# Altium project sonar_board_rev_2013A.PrjPcb
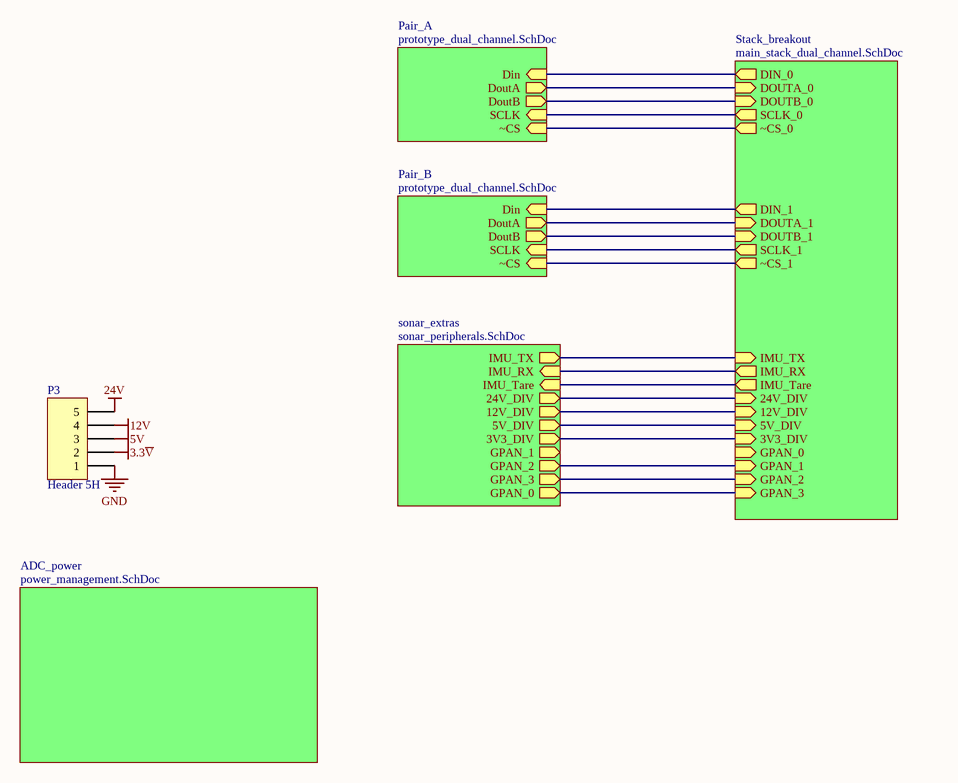
[diagram p0: sonar_board_rev_2013A.SchDoc]
7 sheets, 127 parts. Net scope: hierarchical (ports join the sheet entries above them; power ports are global).
Board file: Sonar_board.PcbDoc
Sheets:
  sonar_board_rev_2013A.SchDoc
    Pair_A = prototype_dual_channel.SchDoc
      Sallen_key_bandpass = Sallen_key_bandpass.SchDoc
      Biasing_circuitry = bias_LNA.SchDoc
      Sallen_key_bandpass = Sallen_key_bandpass.SchDoc
      Biasing_circuitry = bias_LNA.SchDoc
    Pair_B = prototype_dual_channel.SchDoc
      Sallen_key_bandpass = Sallen_key_bandpass.SchDoc
      Biasing_circuitry = bias_LNA.SchDoc
      Sallen_key_bandpass = Sallen_key_bandpass.SchDoc
      Biasing_circuitry = bias_LNA.SchDoc
    Stack_breakout = main_stack_dual_channel.SchDoc
    ADC_power = power_management.SchDoc
    sonar_extras = sonar_peripherals.SchDoc

## Sheet sonar_board_rev_2013A.SchDoc
size A

### Parts
P3  Header 5H  [HDR1X5H]

### Sub-sheets
ADC_power = power_management.SchDoc: no entries
Pair_A = prototype_dual_channel.SchDoc: Din (in), DoutA (out), DoutB (out), SCLK (in), ~CS (in)
Pair_B = prototype_dual_channel.SchDoc: SCLK (in), ~CS (in), DoutA (out), DoutB (out), Din (in)
sonar_extras = sonar_peripherals.SchDoc: IMU_TX (out), IMU_RX (in), IMU_Tare (in), 24V_DIV (out), 12V_DIV (out), 5V_DIV (out), 3V3_DIV (out), GPAN_1 (out), GPAN_2 (out), GPAN_3 (out), GPAN_0 (out)
Stack_breakout = main_stack_dual_channel.SchDoc: DIN_0 (out), DIN_1 (out), DOUTA_0 (in), DOUTA_1 (in), DOUTB_0 (in), DOUTB_1 (in), SCLK_0 (out), SCLK_1 (out), ~CS_0 (out), ~CS_1 (out), IMU_TX (in), IMU_RX (out), IMU_Tare (out), 24V_DIV (in), 12V_DIV (in), 5V_DIV (in), 3V3_DIV (in), GPAN_1 (in), GPAN_3 (in), GPAN_0 (in), GPAN_2 (in)

### Nets
3.3~{V}: P3.2
5V: P3.3
12V: P3.4
24V: P3.5
GND: P3.1
NetADC1_1_23: sheet Pair_A/Din, sheet Stack_breakout/DIN_0
NetADC1_1_31: sheet Pair_A/DoutB, sheet Stack_breakout/DOUTB_0
NetADC1_1_32: sheet Pair_A/DoutA, sheet Stack_breakout/DOUTA_0
NetADC1_1_34: sheet Pair_A/SCLK, sheet Stack_breakout/SCLK_0
NetADC1_1_35: sheet Pair_A/~CS, sheet Stack_breakout/~CS_0
NetADC1_2_23: sheet Pair_B/Din, sheet Stack_breakout/DIN_1
NetADC1_2_31: sheet Pair_B/DoutB, sheet Stack_breakout/DOUTB_1
NetADC1_2_32: sheet Pair_B/DoutA, sheet Stack_breakout/DOUTA_1
NetADC1_2_34: sheet Pair_B/SCLK, sheet Stack_breakout/SCLK_1
NetADC1_2_35: sheet Pair_B/~CS, sheet Stack_breakout/~CS_1
NetC25_2: sheet Stack_breakout/GPAN_3, sheet sonar_extras/GPAN_0
NetC26_2: sheet Stack_breakout/24V_DIV, sheet sonar_extras/24V_DIV
NetC28_2: sheet Stack_breakout/12V_DIV, sheet sonar_extras/12V_DIV
NetC29_2: sheet Stack_breakout/GPAN_1, sheet sonar_extras/GPAN_2
NetC30_2: sheet Stack_breakout/5V_DIV, sheet sonar_extras/5V_DIV
NetC31_2: sheet Stack_breakout/GPAN_2, sheet sonar_extras/GPAN_3
NetC32_2: sheet Stack_breakout/3V3_DIV, sheet sonar_extras/3V3_DIV
NetMS_T1_82: sheet Stack_breakout/IMU_RX, sheet sonar_extras/IMU_RX
NetMS_T1_83: sheet Stack_breakout/IMU_Tare, sheet sonar_extras/IMU_Tare
NetP4_3: sheet Stack_breakout/IMU_TX, sheet sonar_extras/IMU_TX

### Library data of the parts
P3 = Header 5H: Header, 5-Pin, Right Angle; LatestRevisionDate: 17-Jul-2002; LatestRevisionNote: Re-released for DXP Platform.; Publisher: Altium Limited

## Sheet prototype_dual_channel.SchDoc
size A
Used 2 times, as channels Pair_A, Pair_B. Parts and nets are listed once, with the designators drawn on the sheet.
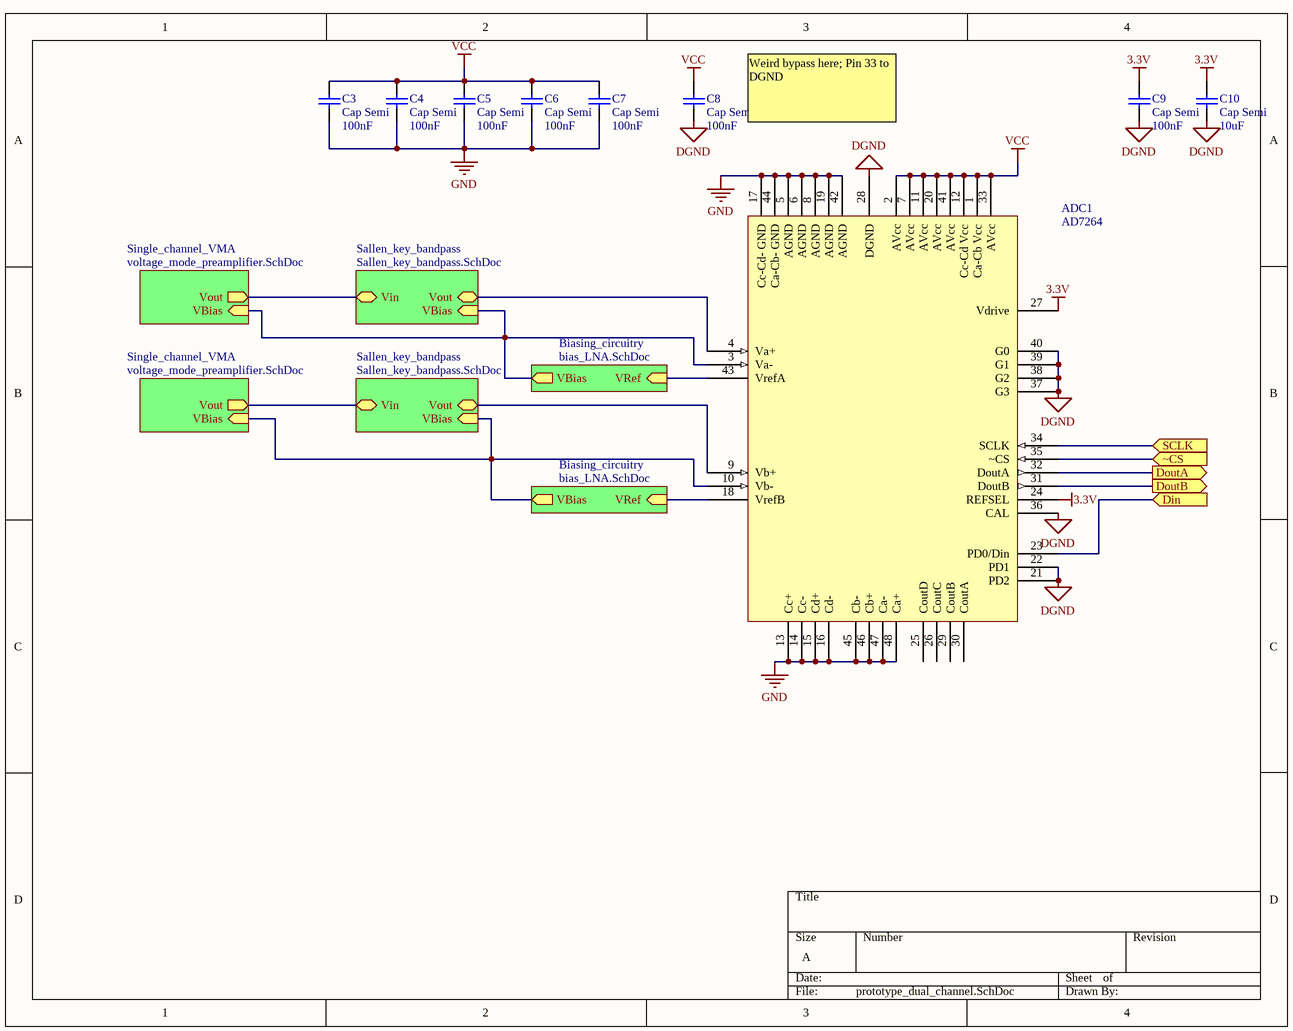
[diagram p1: prototype_dual_channel.SchDoc]

### Parts
ADC1  AD7264  [TSQFP50P900X900-48N]
C3  Cap Semi  value 100nF  [C0805]
C4  Cap Semi  value 100nF  [C0805]
C5  Cap Semi  value 100nF  [C0805]
C6  Cap Semi  value 100nF  [C0805]
C7  Cap Semi  value 100nF  [C0805]
C8  Cap Semi  value 100nF  [C0805]
C9  Cap Semi  value 100nF  [C0805]
C10  Cap Semi  value 10uF  [C0805]

### Sub-sheets
Biasing_circuitry = bias_LNA.SchDoc: VRef (in), VBias (out)
Biasing_circuitry = bias_LNA.SchDoc: VRef (in), VBias (out)
Sallen_key_bandpass = Sallen_key_bandpass.SchDoc: VBias (in), Vin, Vout
Sallen_key_bandpass = Sallen_key_bandpass.SchDoc: VBias (in), Vin, Vout
Single_channel_VMA = voltage_mode_preamplifier.SchDoc (file not in this document): Vout (out), VBias (in)
Single_channel_VMA = voltage_mode_preamplifier.SchDoc (file not in this document): Vout (out), VBias (in)

### Ports
Din (in), DoutA (out), DoutB (out), SCLK (in), ~CS (in)

### Nets
3.3V: ADC1.24(REFSEL) ADC1.27(Vdrive) C9.2 C10.2
DGND: ADC1.21(PD2) ADC1.22(PD1) ADC1.28(DGND) ADC1.36(CAL) ADC1.37(G3) ADC1.38(G2) ADC1.39(G1) ADC1.40(G0) C8.1 C9.1 C10.1
GND: ADC1.5(AGND) ADC1.6(AGND) ADC1.8(AGND) ADC1.13(Cc+) ADC1.14(Cc-) ADC1.15(Cd+) ADC1.16(Cd-) ADC1.17(Cc-Cd-_GND) ADC1.19(AGND) ADC1.42(AGND) ADC1.44(Ca-Cb-_GND) ADC1.45(Cb-) ADC1.46(Cb+) ADC1.47(Ca-) ADC1.48(Ca+) C3.1 C4.1 C5.1 C6.1 C7.1
VCC: ADC1.1(Ca-Cb_Vcc) ADC1.2(AVcc) ADC1.7(AVcc) ADC1.11(AVcc) ADC1.12(Cc-Cd_Vcc) ADC1.20(AVcc) ADC1.33(AVcc) ADC1.41(AVcc) C3.2 C4.2 C5.2 C6.2 C7.2 C8.2
Din: ADC1.23(PD0/Din) ; port Din
DoutA: ADC1.32(DoutA) ; port DoutA
DoutB: ADC1.31(DoutB) ; port DoutB
SCLK: ADC1.34(SCLK) ; port SCLK
~CS: ADC1.35(~CS) ; port ~CS
NetADC1_3: ADC1.3(Va-) ; sheet Single_channel_VMA/VBias, sheet Sallen_key_bandpass/VBias, sheet Biasing_circuitry/VBias
NetADC1_4: ADC1.4(Va+) ; sheet Sallen_key_bandpass/Vout
NetADC1_9: ADC1.9(Vb+) ; sheet Sallen_key_bandpass/Vout
NetADC1_10: ADC1.10(Vb-) ; sheet Single_channel_VMA/VBias, sheet Sallen_key_bandpass/VBias, sheet Biasing_circuitry/VBias
NetADC1_18: ADC1.18(VrefB) ; sheet Biasing_circuitry/VRef
NetADC1_43: ADC1.43(VrefA) ; sheet Biasing_circuitry/VRef
(unnamed): sheet Single_channel_VMA/Vout, sheet Sallen_key_bandpass/Vin
(unnamed): sheet Single_channel_VMA/Vout, sheet Sallen_key_bandpass/Vin

Not connected (* = marked no-connect by the designer): ADC1 25(CoutD) 26(CoutC) 29(CoutB) 30(CoutA)

### Channels
Pair_A: designators end in _1; ports Din=NetADC1_1_23 DoutA=NetADC1_1_32 DoutB=NetADC1_1_31 SCLK=NetADC1_1_34 ~CS=NetADC1_1_35
Pair_B: designators end in _2; ports Din=NetADC1_2_23 DoutA=NetADC1_2_32 DoutB=NetADC1_2_31 SCLK=NetADC1_2_34 ~CS=NetADC1_2_35

### Notes on the sheet
- Weird bypass here; Pin 33 to DGND

### Library data of the parts
ADC1 = AD7264: AD7264 - 14 bit 1MSPS 2 channel ADC; Datasheet: http://www.analog.com/static/imported-files/data_sheets/AD7264.pdf
C3-C10 = Cap Semi: Capacitor (Semiconductor SIM Model); Published: 8-Jun-2000; LatestRevisionDate: 29-May-2009; LatestRevisionNote: IPC-7351 Footprint Added.; PackageReference: C1206; Publisher: Altium Limited; PackageDescription: Chip Capacitor

## Sheet Sallen_key_bandpass.SchDoc
size A
Used 4 times, as channels Pair_A/Sallen_key_bandpass, Pair_A/Sallen_key_bandpass, Pair_B/Sallen_key_bandpass, Pair_B/Sallen_key_bandpass. Parts and nets are listed once, with the designators drawn on the sheet.
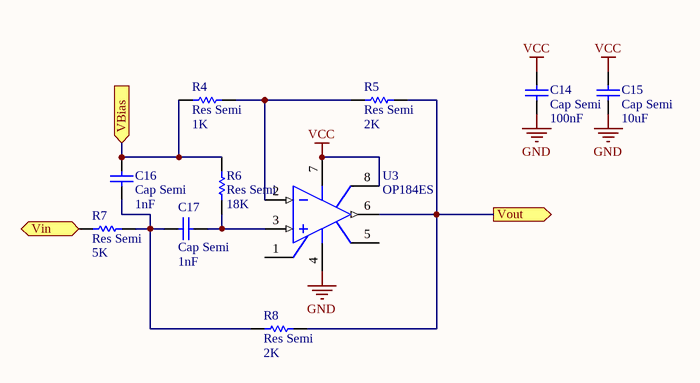
[diagram p2: Sallen_key_bandpass.SchDoc]

### Parts
C14  Cap Semi  value 100nF  [C0805]
C15  Cap Semi  value 10uF  [C1206]
C16  Cap Semi  value 1nF  [C0805]
C17  Cap Semi  value 1nF  [C0805]
R4  Res Semi  value 1K  [6-0805_M]
R5  Res Semi  value 2K  [6-0805_M]
R6  Res Semi  value 18K  [6-0805_M]
R7  Res Semi  value 5K  [6-0805_M]
R8  Res Semi  value 2K  [6-0805_M]
U3  OP184ES  [SO-8]

### Ports
VBias (in), Vin, Vout (out)

### Nets
GND: C14.1 C15.1 U3.4(V-)
VCC: C14.2 C15.2 U3.7(V+) U3.8(NC)
VBias: C16.2 R4.1 R6.2 ; port VBias
Vin: R7.1 ; port Vin
Vout: R5.2 R8.2 U3.6(OUT) ; port Vout
NetC16_1: C16.1 C17.2 R7.2 R8.1
NetC17_1: C17.1 R6.1 U3.3(IN+)
NetR4_2: R4.2 R5.1 U3.2(IN-)

Not connected (* = marked no-connect by the designer): U3 1(NUL) 5(NUL)

### Channels
Pair_A/Sallen_key_bandpass: designators end in _2; ports VBias=NetADC1_1_3 Vin=NetR7_2_1 Vout=NetADC1_1_4
Pair_A/Sallen_key_bandpass: designators end in _1; ports VBias=NetADC1_1_10 Vin=NetR7_1_1 Vout=NetADC1_1_9
Pair_B/Sallen_key_bandpass: designators end in _4; ports VBias=NetADC1_2_3 Vin=NetR7_4_1 Vout=NetADC1_2_4
Pair_B/Sallen_key_bandpass: designators end in _3; ports VBias=NetADC1_2_10 Vin=NetR7_3_1 Vout=NetADC1_2_9

### Library data of the parts
C14 C15 = Cap Semi: Capacitor (Semiconductor SIM Model); Published: 8-Jun-2000; LatestRevisionDate: 29-May-2009; LatestRevisionNote: IPC-7351 Footprint Added.; PackageReference: C1206; Publisher: Altium Limited; PackageDescription: Chip Capacitor
C16 = Cap Semi: Capacitor (Semiconductor SIM Model); Low-pass filter value: OPEN; Published: 8-Jun-2000; LatestRevisionDate: 29-May-2009; LatestRevisionNote: IPC-7351 Footprint Added.; PackageReference: C1206; Publisher: Altium Limited; PackageDescription: Chip Capacitor
C17 = Cap Semi: Capacitor (Semiconductor SIM Model); Low-pass filter value: R = 5K; Published: 8-Jun-2000; LatestRevisionDate: 29-May-2009; LatestRevisionNote: IPC-7351 Footprint Added.; PackageReference: C1206; Publisher: Altium Limited; PackageDescription: Chip Capacitor
R4 = Res Semi: Semiconductor Resistor; Low-pass filter value: OPEN; Published: 8-Jun-2000; LatestRevisionDate: 17-Jul-2002; LatestRevisionNote: Re-released for DXP Platform.; PackageReference: AXIAL-0.5; Publisher: Altium Limited
R5 = Res Semi: Semiconductor Resistor; Low-pass filter value: SHORT; Published: 8-Jun-2000; LatestRevisionDate: 17-Jul-2002; LatestRevisionNote: Re-released for DXP Platform.; PackageReference: AXIAL-0.5; Publisher: Altium Limited
R6 R8 = Res Semi: Semiconductor Resistor; Low-pass filter value: C = 120pF; Published: 8-Jun-2000; LatestRevisionDate: 17-Jul-2002; LatestRevisionNote: Re-released for DXP Platform.; PackageReference: AXIAL-0.5; Publisher: Altium Limited
R7 = Res Semi: Semiconductor Resistor; Low-pass filter value: R = 5k; Published: 8-Jun-2000; LatestRevisionDate: 17-Jul-2002; LatestRevisionNote: Re-released for DXP Platform.; PackageReference: AXIAL-0.5; Publisher: Altium Limited
U3 = OP184ES: Precision Rail-to-Rail Input and Ouput Operational Amplifier; Note: Pin 8 is not connected.; Published: 8-Jun-2000; LatestRevisionDate: 13-Apr-2006; LatestRevisionNote: IPC-7351 Footprint Added.; PackageVersion: revA; PackageReference: SO-8; Publisher: Altium Limited; PackageDescription: 8-Pin Small Outline Integrated Circuit 1.27 mm Pitch; Code_JEDEC: MS-012-AA; Code_IPC: SOIC127P600-8; Datasheet: http://www.analog.com/static/imported-files/data_sheets/OP184_284_484.pdf

## Sheet bias_LNA.SchDoc
size A
Used 4 times, as channels Pair_A/Biasing_circuitry, Pair_A/Biasing_circuitry, Pair_B/Biasing_circuitry, Pair_B/Biasing_circuitry. Parts and nets are listed once, with the designators drawn on the sheet.
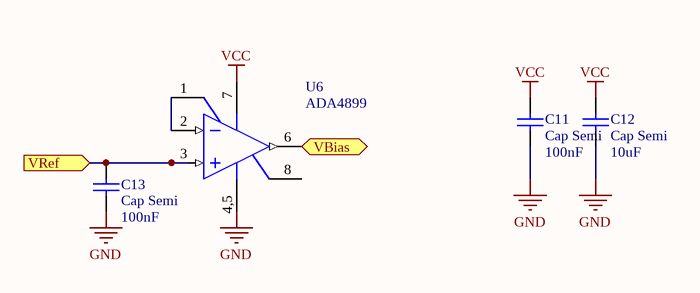
[diagram p3: bias_LNA.SchDoc]

### Parts
C11  Cap Semi  value 100nF  [C0805]
C12  Cap Semi  value 10uF  [C0805]
C13  Cap Semi  value 100nF  [C0805]
U6  ADA4899  [SO8_N]

### Ports
VBias (out), VRef (in)

### Nets
GND: C11.1 C12.1 C13.1 U6.4,5(V-)
VCC: C11.2 C12.2 U6.7(V+)
VBias: U6.6(OUT) ; port VBias
VRef: C13.2 U6.3(IN+) ; port VRef
NetU6_1: U6.1(FB) U6.2(IN-)

Not connected (* = marked no-connect by the designer): U6 8(CMPEN)

### Channels
Pair_A/Biasing_circuitry: designators C11=C11_2 C12=C12_2 C13=C13_2 U6=U2_2; ports VBias=NetADC1_1_3 VRef=NetADC1_1_43
Pair_A/Biasing_circuitry: designators C11=C11_1 C12=C12_1 C13=C13_1 U6=U2_1; ports VBias=NetADC1_1_10 VRef=NetADC1_1_18
Pair_B/Biasing_circuitry: designators C11=C11_4 C12=C12_4 C13=C13_4 U6=U2_4; ports VBias=NetADC1_2_3 VRef=NetADC1_2_43
Pair_B/Biasing_circuitry: designators C11=C11_3 C12=C12_3 C13=C13_3 U6=U2_3; ports VBias=NetADC1_2_10 VRef=NetADC1_2_18

### Library data of the parts
C11-C13 = Cap Semi: Capacitor (Semiconductor SIM Model); Published: 8-Jun-2000; LatestRevisionDate: 29-May-2009; LatestRevisionNote: IPC-7351 Footprint Added.; PackageReference: C1206; Publisher: Altium Limited; PackageDescription: Chip Capacitor
U6 = ADA4899: High Speed, Low Voltage Noise, Unity Gain Stable Op-Amp; Datasheet: http://www.analog.com/static/imported-files/data_sheets/ADA4899-1.pdf; Digikey Product Sheet: http://www.digikey.ca/product-search/en/integrated-circuits-ics/linear-amplifiers-instrumentation-op-amps-buffer-amps/2556125?k=ADA4899

## Sheet main_stack_dual_channel.SchDoc
size A
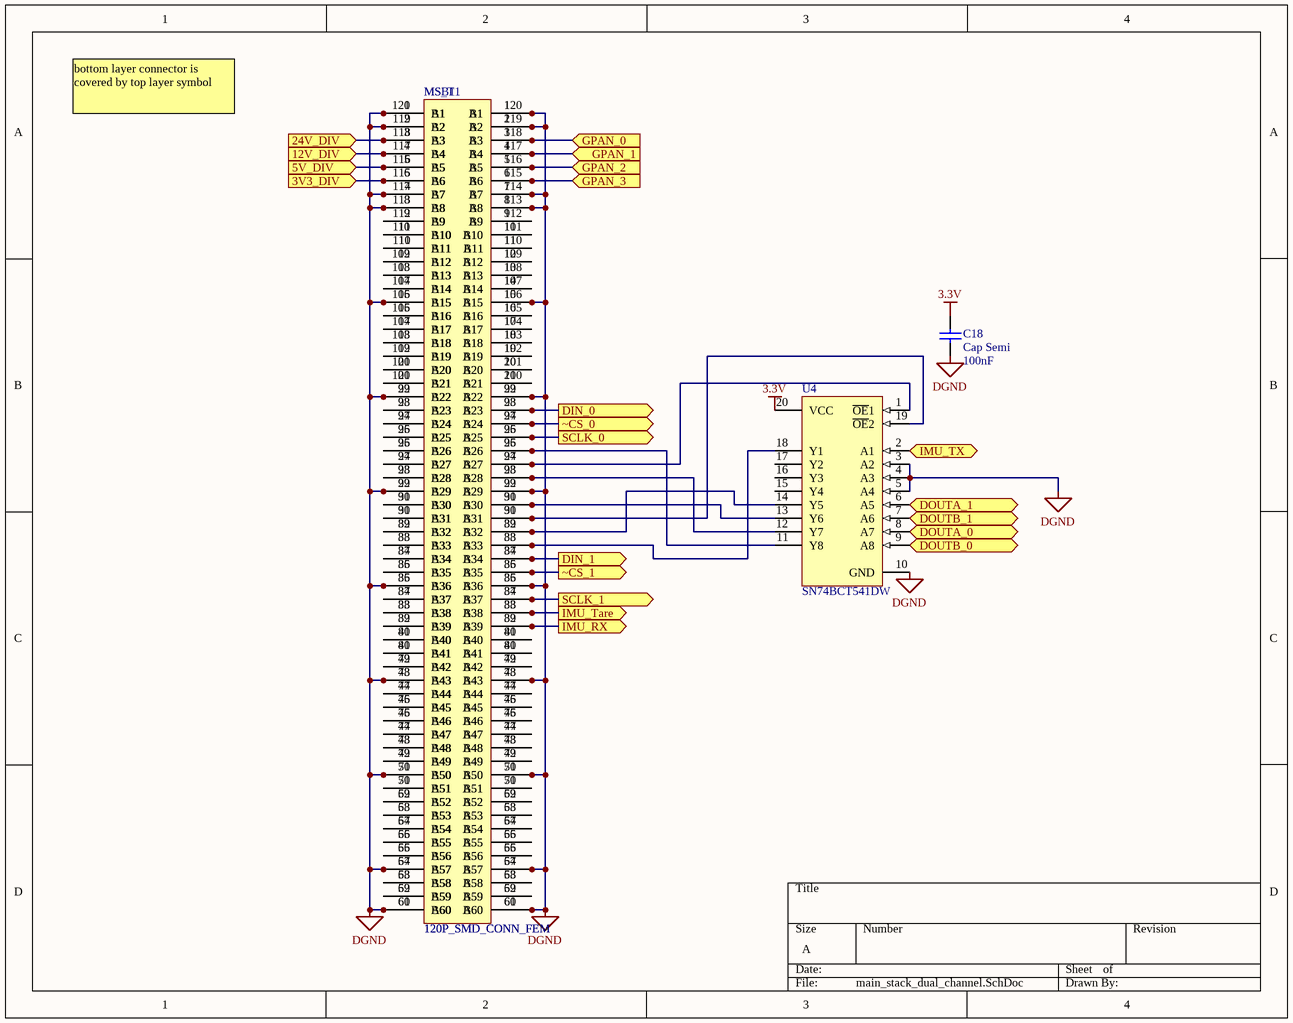
[diagram p4: main_stack_dual_channel.SchDoc]

### Parts
(Parts that share a designator on the sheet are numbered #1, #2 ... from top to bottom, then left to right.)
C18  Cap Semi  value 100nF  [C0805]
MS_T1  120P_SMD_CONN_FEM  [FX2-120P-1.27SV]
MSB1  120P_SMD_CONN_FEM  [FX2-120P-1.27SV]
U4#1  SN74BCT541DW  [DW020]

### Ports
3V3_DIV (in), 5V_DIV (in), 12V_DIV (in), 24V_DIV (in), DIN_0 (out), DIN_1 (out), DOUTA_0 (in), DOUTA_1 (in), DOUTB_0 (in), DOUTB_1 (in), GPAN_0 (in), GPAN_1 (in), GPAN_2 (in), GPAN_3 (in), IMU_RX (out), IMU_Tare (out), IMU_TX (in), SCLK_0 (out), SCLK_1 (out), ~CS_0 (out), ~CS_1 (out)

### Nets
3.3V: C18.2 U4#1.20(VCC)
DGND: C18.1 MS_T1.1(A1) MS_T1.2(A2) MS_T1.7(A7) MS_T1.8(A8) MS_T1.15(A15) MS_T1.22(A22) MS_T1.29(A29) MS_T1.36(A36) MS_T1.43(A43) MS_T1.50(A50) MS_T1.57(A57) MS_T1.60(A60) MS_T1.61(B60) MS_T1.64(B57) MS_T1.71(B50) MS_T1.78(B43) MS_T1.85(B36) MS_T1.92(B29) MS_T1.99(B22) MS_T1.106(B15) MS_T1.113(B8) MS_T1.114(B7) MS_T1.119(B2) MS_T1.120(B1) MSB1.1(A1) MSB1.2(A2) MSB1.7(A7) MSB1.8(A8) MSB1.15(A15) MSB1.22(A22) MSB1.29(A29) MSB1.36(A36) MSB1.43(A43) MSB1.50(A50) MSB1.57(A57) MSB1.60(A60) MSB1.61(B60) MSB1.64(B57) MSB1.71(B50) MSB1.78(B43) MSB1.85(B36) MSB1.92(B29) MSB1.99(B22) MSB1.106(B15) MSB1.113(B8) MSB1.114(B7) MSB1.119(B2) MSB1.120(B1) U4#1.3(A2) U4#1.4(A3) U4#1.5(A4) U4#1.10(GND)
NetADC1_1_23: MS_T1.98(B23) MSB1.23(A23) ; port DIN_0
NetADC1_1_31: U4#1.9(A8) ; port DOUTB_0
NetADC1_1_32: U4#1.8(A7) ; port DOUTA_0
NetADC1_1_34: MS_T1.96(B25) MSB1.25(A25) ; port SCLK_0
NetADC1_1_35: MS_T1.97(B24) MSB1.24(A24) ; port ~CS_0
NetADC1_2_23: MS_T1.87(B34) MSB1.34(A34) ; port DIN_1
NetADC1_2_31: U4#1.7(A6) ; port DOUTB_1
NetADC1_2_32: U4#1.6(A5) ; port DOUTA_1
NetADC1_2_34: MS_T1.84(B37) MSB1.37(A37) ; port SCLK_1
NetADC1_2_35: MS_T1.86(B35) MSB1.35(A35) ; port ~CS_1
NetC25_2: MS_T1.115(B6) MSB1.6(A6) ; port GPAN_3
NetC26_2: MS_T1.3(A3) MSB1.118(B3) ; port 24V_DIV
NetC28_2: MS_T1.4(A4) MSB1.117(B4) ; port 12V_DIV
NetC29_2: MS_T1.117(B4) MSB1.4(A4) ; port GPAN_1
NetC30_2: MS_T1.5(A5) MSB1.116(B5) ; port 5V_DIV
NetC31_2: MS_T1.116(B5) MSB1.5(A5) ; port GPAN_2
NetC32_2: MS_T1.6(A6) MSB1.115(B6) ; port 3V3_DIV
NetMS_T1_9: MS_T1.9(A9) MSB1.112(B9)
NetMS_T1_10: MS_T1.10(A10) MSB1.111(B10)
NetMS_T1_11: MS_T1.11(A11) MSB1.110(B11)
NetMS_T1_12: MS_T1.12(A12) MSB1.109(B12)
NetMS_T1_13: MS_T1.13(A13) MSB1.108(B13)
NetMS_T1_14: MS_T1.14(A14) MSB1.107(B14)
NetMS_T1_16: MS_T1.16(A16) MSB1.105(B16)
NetMS_T1_17: MS_T1.17(A17) MSB1.104(B17)
NetMS_T1_18: MS_T1.18(A18) MSB1.103(B18)
NetMS_T1_19: MS_T1.19(A19) MSB1.102(B19)
NetMS_T1_20: MS_T1.20(A20) MSB1.101(B20)
NetMS_T1_21: MS_T1.21(A21) MSB1.100(B21)
NetMS_T1_23: MS_T1.23(A23) MSB1.98(B23)
NetMS_T1_24: MS_T1.24(A24) MSB1.97(B24)
NetMS_T1_25: MS_T1.25(A25) MSB1.96(B25)
NetMS_T1_26: MS_T1.26(A26) MSB1.95(B26)
NetMS_T1_27: MS_T1.27(A27) MSB1.94(B27)
NetMS_T1_28: MS_T1.28(A28) MSB1.93(B28)
NetMS_T1_30: MS_T1.30(A30) MSB1.91(B30)
NetMS_T1_31: MS_T1.31(A31) MSB1.90(B31)
NetMS_T1_32: MS_T1.32(A32) MSB1.89(B32)
NetMS_T1_33: MS_T1.33(A33) MSB1.88(B33)
NetMS_T1_34: MS_T1.34(A34) MSB1.87(B34)
NetMS_T1_35: MS_T1.35(A35) MSB1.86(B35)
NetMS_T1_37: MS_T1.37(A37) MSB1.84(B37)
NetMS_T1_38: MS_T1.38(A38) MSB1.83(B38)
NetMS_T1_39: MS_T1.39(A39) MSB1.82(B39)
NetMS_T1_40: MS_T1.40(A40) MSB1.81(B40)
NetMS_T1_41: MS_T1.41(A41) MSB1.80(B41)
NetMS_T1_42: MS_T1.42(A42) MSB1.79(B42)
NetMS_T1_44: MS_T1.44(A44) MSB1.77(B44)
NetMS_T1_45: MS_T1.45(A45) MSB1.76(B45)
NetMS_T1_46: MS_T1.46(A46) MSB1.75(B46)
NetMS_T1_47: MS_T1.47(A47) MSB1.74(B47)
NetMS_T1_48: MS_T1.48(A48) MSB1.73(B48)
NetMS_T1_49: MS_T1.49(A49) MSB1.72(B49)
NetMS_T1_51: MS_T1.51(A51) MSB1.70(B51)
NetMS_T1_52: MS_T1.52(A52) MSB1.69(B52)
NetMS_T1_53: MS_T1.53(A53) MSB1.68(B53)
NetMS_T1_54: MS_T1.54(A54) MSB1.67(B54)
NetMS_T1_55: MS_T1.55(A55) MSB1.66(B55)
NetMS_T1_56: MS_T1.56(A56) MSB1.65(B56)
NetMS_T1_58: MS_T1.58(A58) MSB1.63(B58)
NetMS_T1_59: MS_T1.59(A59) MSB1.62(B59)
NetMS_T1_62: MS_T1.62(B59) MSB1.59(A59)
NetMS_T1_63: MS_T1.63(B58) MSB1.58(A58)
NetMS_T1_65: MS_T1.65(B56) MSB1.56(A56)
NetMS_T1_66: MS_T1.66(B55) MSB1.55(A55)
NetMS_T1_67: MS_T1.67(B54) MSB1.54(A54)
NetMS_T1_68: MS_T1.68(B53) MSB1.53(A53)
NetMS_T1_69: MS_T1.69(B52) MSB1.52(A52)
NetMS_T1_70: MS_T1.70(B51) MSB1.51(A51)
NetMS_T1_72: MS_T1.72(B49) MSB1.49(A49)
NetMS_T1_73: MS_T1.73(B48) MSB1.48(A48)
NetMS_T1_74: MS_T1.74(B47) MSB1.47(A47)
NetMS_T1_75: MS_T1.75(B46) MSB1.46(A46)
NetMS_T1_76: MS_T1.76(B45) MSB1.45(A45)
NetMS_T1_77: MS_T1.77(B44) MSB1.44(A44)
NetMS_T1_79: MS_T1.79(B42) MSB1.42(A42)
NetMS_T1_80: MS_T1.80(B41) MSB1.41(A41)
NetMS_T1_81: MS_T1.81(B40) MSB1.40(A40)
NetMS_T1_82: MS_T1.82(B39) MSB1.39(A39) ; port IMU_RX
NetMS_T1_83: MS_T1.83(B38) MSB1.38(A38) ; port IMU_Tare
NetMS_T1_88: MS_T1.88(B33) MSB1.33(A33) U4#1.18(Y1)
NetMS_T1_89: MS_T1.89(B32) MSB1.32(A32) U4#1.14(Y5)
NetMS_T1_90: MS_T1.90(B31) MSB1.31(A31) U4#1.19(~{OE}2)
NetMS_T1_91: MS_T1.91(B30) MSB1.30(A30) U4#1.13(Y6)
NetMS_T1_93: MS_T1.93(B28) MSB1.28(A28) U4#1.12(Y7)
NetMS_T1_94: MS_T1.94(B27) MSB1.27(A27) U4#1.1(~{OE}1)
NetMS_T1_95: MS_T1.95(B26) MSB1.26(A26) U4#1.11(Y8)
NetMS_T1_100: MS_T1.100(B21) MSB1.21(A21)
NetMS_T1_101: MS_T1.101(B20) MSB1.20(A20)
NetMS_T1_102: MS_T1.102(B19) MSB1.19(A19)
NetMS_T1_103: MS_T1.103(B18) MSB1.18(A18)
NetMS_T1_104: MS_T1.104(B17) MSB1.17(A17)
NetMS_T1_105: MS_T1.105(B16) MSB1.16(A16)
NetMS_T1_107: MS_T1.107(B14) MSB1.14(A14)
NetMS_T1_108: MS_T1.108(B13) MSB1.13(A13)
NetMS_T1_109: MS_T1.109(B12) MSB1.12(A12)
NetMS_T1_110: MS_T1.110(B11) MSB1.11(A11)
NetMS_T1_111: MS_T1.111(B10) MSB1.10(A10)
NetMS_T1_112: MS_T1.112(B9) MSB1.9(A9)
NetMS_T1_118: MS_T1.118(B3) MSB1.3(A3) ; port GPAN_0
NetP4_3: U4#1.2(A1) ; port IMU_TX

Not connected (* = marked no-connect by the designer): U4#1 15(Y4) 16(Y3) 17(Y2)

### Notes on the sheet
- bottom layer connector is covered by top layer symbol

### Library data of the parts
C18 = Cap Semi: Capacitor (Semiconductor SIM Model); Published: 8-Jun-2000; LatestRevisionDate: 29-May-2009; LatestRevisionNote: IPC-7351 Footprint Added.; PackageReference: C1206; Publisher: Altium Limited; PackageDescription: Chip Capacitor
MS_T1 MSB1 = 120P_SMD_CONN_FEM: Main Stack Connector, Female; Part Number: FX2-120P-1.27SV(71)
  MSB1: Datasheet: http://www.hirose.co.jp/cataloge_hp/e57220088.pdf
U4#1 = SN74BCT541DW: Octal Buffer/Driver with 3-State Outputs; ComponentAvailability: Obsolete; Published: 8-Jun-2000; LatestRevisionDate: 13-Apr-2006; LatestRevisionNote: IPC-7351 Footprint Added.; DatasheetVersion: Apr-1994; PackageVersion: Mar-2000; PackageReference: DW020; Publisher: Altium Limited; PackageDescription: 20-Pin Plastic Small Outline Integrated Circuit 1.27 mm Pitch; Code_JEDEC: MS-013; Code_IPC: SOIC127P1030-20; ComponentLink1Description: Manufacturer Link; ComponentLink1URL: http://www.ti.com/; ComponentLink2Description: Discontinuation Notice; ComponentLink2URL: http://focus.ti.com/docs/prod/folders/print/sn74bct541.html; Datasheet: http://www.ti.com/lit/ds/symlink/sn74bct541a.pdf; Digikey PN: 296-33840-5-ND

## Sheet power_management.SchDoc
size A
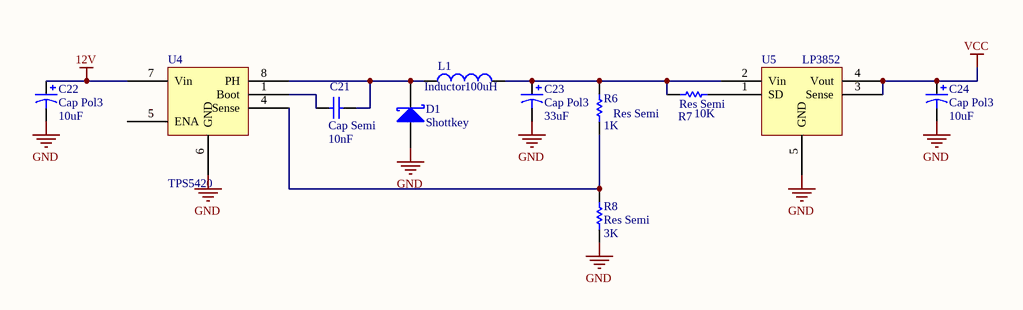
[diagram p5: power_management.SchDoc]

### Parts
(Parts that share a designator on the sheet are numbered #1, #2 ... from top to bottom, then left to right.)
C21  Cap Semi  value 10nF  [C0805]
C22  Cap Pol3  value 10uF  [TC6032-2412]
C23  Cap Pol3  value 33uF  [TC6032-2412]
C24  Cap Pol3  value 10uF  [TC3216-1206]
D1  Shottkey  [TO-220AC]
L1  Inductor  value 100uH  [SB_IND]
R6  Res Semi  value 1K  [6-0805_M]
R7  Res Semi  value 10K  [6-0805_M]
R8  Res Semi  value 3K  [6-0805_M]
U4#2  TPS5420  [SO8_M]
U5  LP3852  [SOT223-5N]

### Nets
12V: C22.1 U4#2.7(Vin)
GND: C22.2 C23.2 C24.2 D1.3(A) R8.1 U4#2.6(GND) U5.5(GND)
VCC: C24.1 U5.3(Sense) U5.4(Vout)
NetC21_1: C21.1 U4#2.1(Boot)
NetC21_2: C21.2 D1.1(K) L1.1 U4#2.8(PH)
NetC23_1: C23.1 L1.2 R6.2 R7.1 U5.2(Vin)
NetR6_1: R6.1 R8.2 U4#2.4(Sense)
NetR7_2: R7.2 U5.1(SD)

Not connected (* = marked no-connect by the designer): U4#2 5(ENA)

### Library data of the parts
C21 = Cap Semi: Capacitor (Semiconductor SIM Model); Published: 8-Jun-2000; LatestRevisionDate: 29-May-2009; LatestRevisionNote: IPC-7351 Footprint Added.; PackageReference: C1206; Publisher: Altium Limited; PackageDescription: Chip Capacitor
C22-C24 = Cap Pol3: Polarized Capacitor (Surface Mount); Published: 8-Jun-2000; LatestRevisionDate: 29-May-2009; LatestRevisionNote: IPC-7351 Footprint Added.; PackageReference: C0805; Publisher: Altium Limited; PackageDescription: Chip Capacitor
  C22: Digikey PN: 718-1052-6-ND
  C23: Digikey PN: 718-1077-1-ND
D1 = Diode 10TQ035: Schottky Rectifier; Note: Terminal 2 is the TAB and is electrically connected to the cathode; Published: 8-Jun-2000; LatestRevisionDate: 17-Jul-2002; LatestRevisionNote: Re-released for DXP Platform.; DatasheetVersion: PD-2.057B; PackageVersion: Feb-1998; PackageReference: TO-220AC; Publisher: Altium Limited; PackageDescription: TO, Thru-Hole, Vertical, Heatsink Mounted; 3 In-Line Leads (1 Absent); Pitch 2.54 mm; ComponentLink1Description: Manufacturer Link; ComponentLink1URL: http://www.irf.com/; ComponentLink2Description: Datasheet; ComponentLink2URL: http://www.irf.com/product-info/datasheets/data/10tq.pdf; Digikey PN: B340A-FDICT-ND
L1 = Inductor: Code_IEC: 1005; Published: 8-Jun-2000; LatestRevisionDate: 29-May-2009; LatestRevisionNote: IPC-7351 Footprint Added.; PackageReference: 0402-A; Publisher: Altium Limited; PackageDescription: Chip Inductor; Code_JEITA: 0402; Digikey PN: 495-1987-1-ND
R6-R8 = Res Semi: Semiconductor Resistor; Published: 8-Jun-2000; LatestRevisionDate: 17-Jul-2002; LatestRevisionNote: Re-released for DXP Platform.; PackageReference: AXIAL-0.5; Publisher: Altium Limited
  R6 R8: PackageDescription: Axial Device, Thru-Hole; 2 Leads; 0.5 in Pin Spacing
U4#2 = TPS5420: 2A Wide Input Range Step-Down Swift Converter; Datasheet: http://www.ti.com/lit/ds/symlink/tps5420.pdf; Digikey PN: 296-19671-5-ND
U5 = LP3852: 1.5A Fast Response Ultra Low Dropout Linear Regulator; Digikey PN: LP3852EMP-5.0/NOPBCT-ND; Datasheet: http://www.ti.com/lit/ds/symlink/lp3852.pdf

## Sheet sonar_peripherals.SchDoc
size A
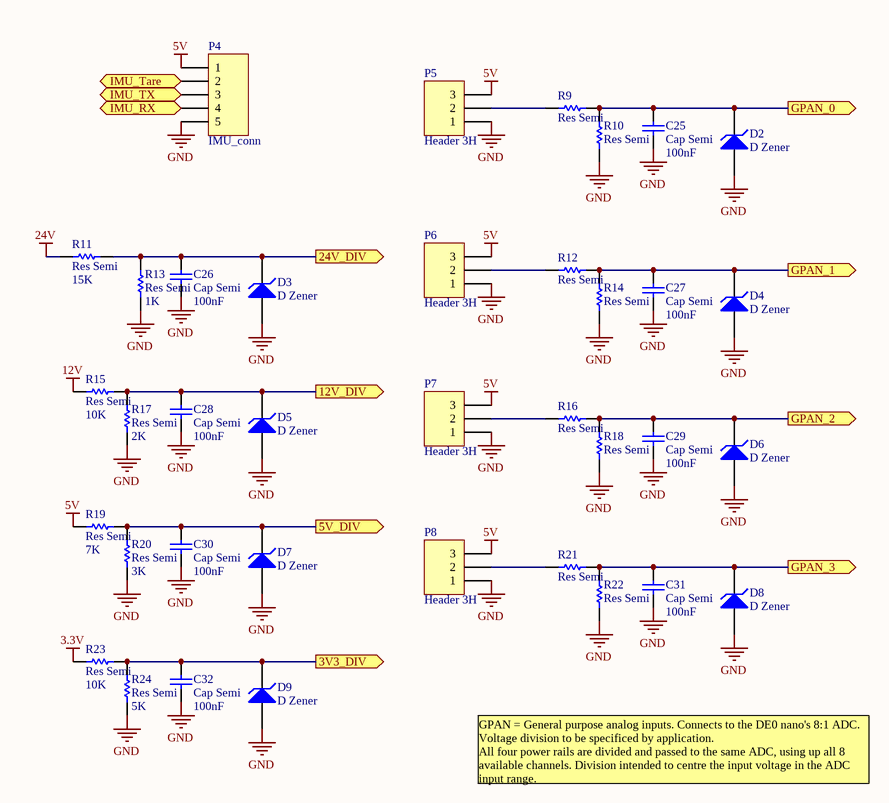
[diagram p6: sonar_peripherals.SchDoc]

### Parts
C25  Cap Semi  value 100nF  [C0805]
C26  Cap Semi  value 100nF  [C0805]
C27  Cap Semi  value 100nF  [C0805]
C28  Cap Semi  value 100nF  [C0805]
C29  Cap Semi  value 100nF  [C0805]
C30  Cap Semi  value 100nF  [C0805]
C31  Cap Semi  value 100nF  [C0805]
C32  Cap Semi  value 100nF  [C0805]
D2  D Zener  [SOD-323]
D3  D Zener  [SOD-323]
D4  D Zener  [SOD-323]
D5  D Zener  [SOD-323]
D6  D Zener  [SOD-323]
D7  D Zener  [SOD-323]
D8  D Zener  [SOD-323]
D9  D Zener  [SOD-323]
P4  IMU_conn  [HDR1X5H]
P5  Header 3H  [HDR1X3H]
P6  Header 3H  [HDR1X3H]
P7  Header 3H  [HDR1X3H]
P8  Header 3H  [HDR1X3H]
R9  Res Semi  [6-0805_M]
R10  Res Semi  [6-0805_M]
R11  Res Semi  value 15K  [6-0805_M]
R12  Res Semi  [6-0805_M]
R13  Res Semi  value 1K  [6-0805_M]
R14  Res Semi  [6-0805_M]
R15  Res Semi  value 10K  [6-0805_M]
R16  Res Semi  [6-0805_M]
R17  Res Semi  value 2K  [6-0805_M]
R18  Res Semi  [6-0805_M]
R19  Res Semi  value 7K  [6-0805_M]
R20  Res Semi  value 3K  [6-0805_M]
R21  Res Semi  [6-0805_M]
R22  Res Semi  [6-0805_M]
R23  Res Semi  value 10K  [6-0805_M]
R24  Res Semi  value 5K  [6-0805_M]

### Ports
3V3_DIV (out), 5V_DIV (out), 12V_DIV (out), 24V_DIV (out), GPAN_0 (out), GPAN_1 (out), GPAN_2 (out), GPAN_3 (out), IMU_RX (in), IMU_Tare (in), IMU_TX (out)

### Nets
3.3V: R23.1
5V: P4.1 P5.3 P6.3 P7.3 P8.3 R19.1
12V: R15.1
24V: R11.1
GND: C25.1 C26.1 C27.1 C28.1 C29.1 C30.1 C31.1 C32.1 D2.1(A) D3.1(A) D4.1(A) D5.1(A) D6.1(A) D7.1(A) D8.1(A) D9.1(A) P4.5 P5.1 P6.1 P7.1 P8.1 R10.1 R13.1 R14.1 R17.1 R18.1 R20.1 R22.1 R24.1
NetC25_2: C25.2 D2.2(K) R9.2 R10.2 ; port GPAN_0
NetC26_2: C26.2 D3.2(K) R11.2 R13.2 ; port 24V_DIV
NetC27_2: C27.2 D4.2(K) R12.2 R14.2 ; port GPAN_1
NetC28_2: C28.2 D5.2(K) R15.2 R17.2 ; port 12V_DIV
NetC29_2: C29.2 D6.2(K) R16.2 R18.2 ; port GPAN_2
NetC30_2: C30.2 D7.2(K) R19.2 R20.2 ; port 5V_DIV
NetC31_2: C31.2 D8.2(K) R21.2 R22.2 ; port GPAN_3
NetC32_2: C32.2 D9.2(K) R23.2 R24.2 ; port 3V3_DIV
NetMS_T1_82: P4.4 ; port IMU_RX
NetMS_T1_83: P4.2 ; port IMU_Tare
NetP4_3: P4.3 ; port IMU_TX
NetP5_2: P5.2 R9.1
NetP6_2: P6.2 R12.1
NetP7_2: P7.2 R16.1
NetP8_2: P8.2 R21.1

### Notes on the sheet
- GPAN = General purpose analog inputs. Connects to the DE0 nano's 8:1 ADC.  Voltage division to be specificed by application.
  All four power rails are divided and passed to the same ADC, using up all 8 available channels. Division intended to centre the input voltage in the ADC input range.

### Library data of the parts
C25-C32 = Cap Semi: Capacitor (Semiconductor SIM Model); Published: 8-Jun-2000; LatestRevisionDate: 29-May-2009; LatestRevisionNote: IPC-7351 Footprint Added.; PackageReference: C1206; Publisher: Altium Limited; PackageDescription: Chip Capacitor
D2-D9 = D Zener: Zener Diode; Published: 8-Jun-2000; LatestRevisionDate: 17-Jul-2002; LatestRevisionNote: Re-released for DXP Platform.; PackageReference: DIODE-0.7; Publisher: Altium Limited; PackageDescription: Diode, Thru-Hole; 2 Leads; 0.7 in Pin Spacing
P4 = Header 5H: Header, 5-Pin, Right Angle; LatestRevisionDate: 17-Jul-2002; LatestRevisionNote: Re-released for DXP Platform.; Publisher: Altium Limited
P5-P8 = Header 3H: Header, 3-Pin, Right Angle; LatestRevisionDate: 17-Jul-2002; LatestRevisionNote: Re-released for DXP Platform.; Publisher: Altium Limited
R9 R12 R16 R21 = Res Semi: Semiconductor Resistor; Value: 10K; Published: 8-Jun-2000; LatestRevisionDate: 17-Jul-2002; LatestRevisionNote: Re-released for DXP Platform.; PackageReference: AXIAL-0.5; Publisher: Altium Limited; PackageDescription: Axial Device, Thru-Hole; 2 Leads; 0.5 in Pin Spacing
R10 R14 R18 R22 = Res Semi: Semiconductor Resistor; Value: 2K; Published: 8-Jun-2000; LatestRevisionDate: 17-Jul-2002; LatestRevisionNote: Re-released for DXP Platform.; PackageReference: AXIAL-0.5; Publisher: Altium Limited; PackageDescription: Axial Device, Thru-Hole; 2 Leads; 0.5 in Pin Spacing
R11 R13 R15 R17 R19 R20 R23 R24 = Res Semi: Semiconductor Resistor; Published: 8-Jun-2000; LatestRevisionDate: 17-Jul-2002; LatestRevisionNote: Re-released for DXP Platform.; PackageReference: AXIAL-0.5; Publisher: Altium Limited; PackageDescription: Axial Device, Thru-Hole; 2 Leads; 0.5 in Pin Spacing

## Nets that join several sheets
3.3V: Pair_A (ADC1_1.24 ADC1_1.27 C9_1.2 C10_1.2), Pair_B (ADC1_2.24 ADC1_2.27 C9_2.2 C10_2.2), main_stack_dual_channel (C18.2 U4#1.20), sonar_peripherals (R23.1)
5V: sonar_board_rev_2013A (P3.3), sonar_peripherals (6 pins)
12V: sonar_board_rev_2013A (P3.4), power_management (C22.1 U4#2.7), sonar_peripherals (R15.1)
24V: sonar_board_rev_2013A (P3.5), sonar_peripherals (R11.1)
DGND: Pair_A (11 pins), Pair_B (11 pins), main_stack_dual_channel (53 pins)
GND: sonar_board_rev_2013A (P3.1), Pair_A (20 pins), Pair_A/Sallen_key_bandpass (C14_2.1 C15_2.1 U3_2.4), Pair_A/Biasing_circuitry (C11_2.1 C12_2.1 C13_2.1 U2_2.4,5), Pair_A/Sallen_key_bandpass (C14_1.1 C15_1.1 U3_1.4), Pair_A/Biasing_circuitry (C11_1.1 C12_1.1 C13_1.1 U2_1.4,5), Pair_B (20 pins), Pair_B/Sallen_key_bandpass (C14_4.1 C15_4.1 U3_4.4), Pair_B/Biasing_circuitry (C11_4.1 C12_4.1 C13_4.1 U2_4.4,5), Pair_B/Sallen_key_bandpass (C14_3.1 C15_3.1 U3_3.4), Pair_B/Biasing_circuitry (C11_3.1 C12_3.1 C13_3.1 U2_3.4,5), power_management (7 pins), sonar_peripherals (29 pins)
VCC: Pair_A (14 pins), Pair_A/Sallen_key_bandpass (C14_2.2 C15_2.2 U3_2.7 U3_2.8), Pair_A/Biasing_circuitry (C11_2.2 C12_2.2 U2_2.7), Pair_A/Sallen_key_bandpass (C14_1.2 C15_1.2 U3_1.7 U3_1.8), Pair_A/Biasing_circuitry (C11_1.2 C12_1.2 U2_1.7), Pair_B (14 pins), Pair_B/Sallen_key_bandpass (C14_4.2 C15_4.2 U3_4.7 U3_4.8), Pair_B/Biasing_circuitry (C11_4.2 C12_4.2 U2_4.7), Pair_B/Sallen_key_bandpass (C14_3.2 C15_3.2 U3_3.7 U3_3.8), Pair_B/Biasing_circuitry (C11_3.2 C12_3.2 U2_3.7), power_management (C24.1 U5.3 U5.4)
NetADC1_1_3: Pair_A (ADC1_1.3), Pair_A/Sallen_key_bandpass (C16_2.2 R4_2.1 R6_2.2), Pair_A/Biasing_circuitry (U2_2.6)
NetADC1_1_4: Pair_A (ADC1_1.4), Pair_A/Sallen_key_bandpass (R5_2.2 R8_2.2 U3_2.6)
NetADC1_1_9: Pair_A (ADC1_1.9), Pair_A/Sallen_key_bandpass (R5_1.2 R8_1.2 U3_1.6)
NetADC1_1_10: Pair_A (ADC1_1.10), Pair_A/Sallen_key_bandpass (C16_1.2 R4_1.1 R6_1.2), Pair_A/Biasing_circuitry (U2_1.6)
NetADC1_1_18: Pair_A (ADC1_1.18), Pair_A/Biasing_circuitry (C13_1.2 U2_1.3)
NetADC1_1_23: Pair_A (ADC1_1.23), main_stack_dual_channel (MS_T1.98 MSB1.23)
NetADC1_1_31: Pair_A (ADC1_1.31), main_stack_dual_channel (U4#1.9)
NetADC1_1_32: Pair_A (ADC1_1.32), main_stack_dual_channel (U4#1.8)
NetADC1_1_34: Pair_A (ADC1_1.34), main_stack_dual_channel (MS_T1.96 MSB1.25)
NetADC1_1_35: Pair_A (ADC1_1.35), main_stack_dual_channel (MS_T1.97 MSB1.24)
NetADC1_1_43: Pair_A (ADC1_1.43), Pair_A/Biasing_circuitry (C13_2.2 U2_2.3)
NetADC1_2_3: Pair_B (ADC1_2.3), Pair_B/Sallen_key_bandpass (C16_4.2 R4_4.1 R6_4.2), Pair_B/Biasing_circuitry (U2_4.6)
NetADC1_2_4: Pair_B (ADC1_2.4), Pair_B/Sallen_key_bandpass (R5_4.2 R8_4.2 U3_4.6)
NetADC1_2_9: Pair_B (ADC1_2.9), Pair_B/Sallen_key_bandpass (R5_3.2 R8_3.2 U3_3.6)
NetADC1_2_10: Pair_B (ADC1_2.10), Pair_B/Sallen_key_bandpass (C16_3.2 R4_3.1 R6_3.2), Pair_B/Biasing_circuitry (U2_3.6)
NetADC1_2_18: Pair_B (ADC1_2.18), Pair_B/Biasing_circuitry (C13_3.2 U2_3.3)
NetADC1_2_23: Pair_B (ADC1_2.23), main_stack_dual_channel (MS_T1.87 MSB1.34)
NetADC1_2_31: Pair_B (ADC1_2.31), main_stack_dual_channel (U4#1.7)
NetADC1_2_32: Pair_B (ADC1_2.32), main_stack_dual_channel (U4#1.6)
NetADC1_2_34: Pair_B (ADC1_2.34), main_stack_dual_channel (MS_T1.84 MSB1.37)
NetADC1_2_35: Pair_B (ADC1_2.35), main_stack_dual_channel (MS_T1.86 MSB1.35)
NetADC1_2_43: Pair_B (ADC1_2.43), Pair_B/Biasing_circuitry (C13_4.2 U2_4.3)
NetC25_2: main_stack_dual_channel (MS_T1.115 MSB1.6), sonar_peripherals (C25.2 D2.2 R9.2 R10.2)
NetC26_2: main_stack_dual_channel (MS_T1.3 MSB1.118), sonar_peripherals (C26.2 D3.2 R11.2 R13.2)
NetC28_2: main_stack_dual_channel (MS_T1.4 MSB1.117), sonar_peripherals (C28.2 D5.2 R15.2 R17.2)
NetC29_2: main_stack_dual_channel (MS_T1.117 MSB1.4), sonar_peripherals (C29.2 D6.2 R16.2 R18.2)
NetC30_2: main_stack_dual_channel (MS_T1.5 MSB1.116), sonar_peripherals (C30.2 D7.2 R19.2 R20.2)
NetC31_2: main_stack_dual_channel (MS_T1.116 MSB1.5), sonar_peripherals (C31.2 D8.2 R21.2 R22.2)
NetC32_2: main_stack_dual_channel (MS_T1.6 MSB1.115), sonar_peripherals (C32.2 D9.2 R23.2 R24.2)
NetMS_T1_82: main_stack_dual_channel (MS_T1.82 MSB1.39), sonar_peripherals (P4.4)
NetMS_T1_83: main_stack_dual_channel (MS_T1.83 MSB1.38), sonar_peripherals (P4.2)
NetP4_3: main_stack_dual_channel (U4#1.2), sonar_peripherals (P4.3)